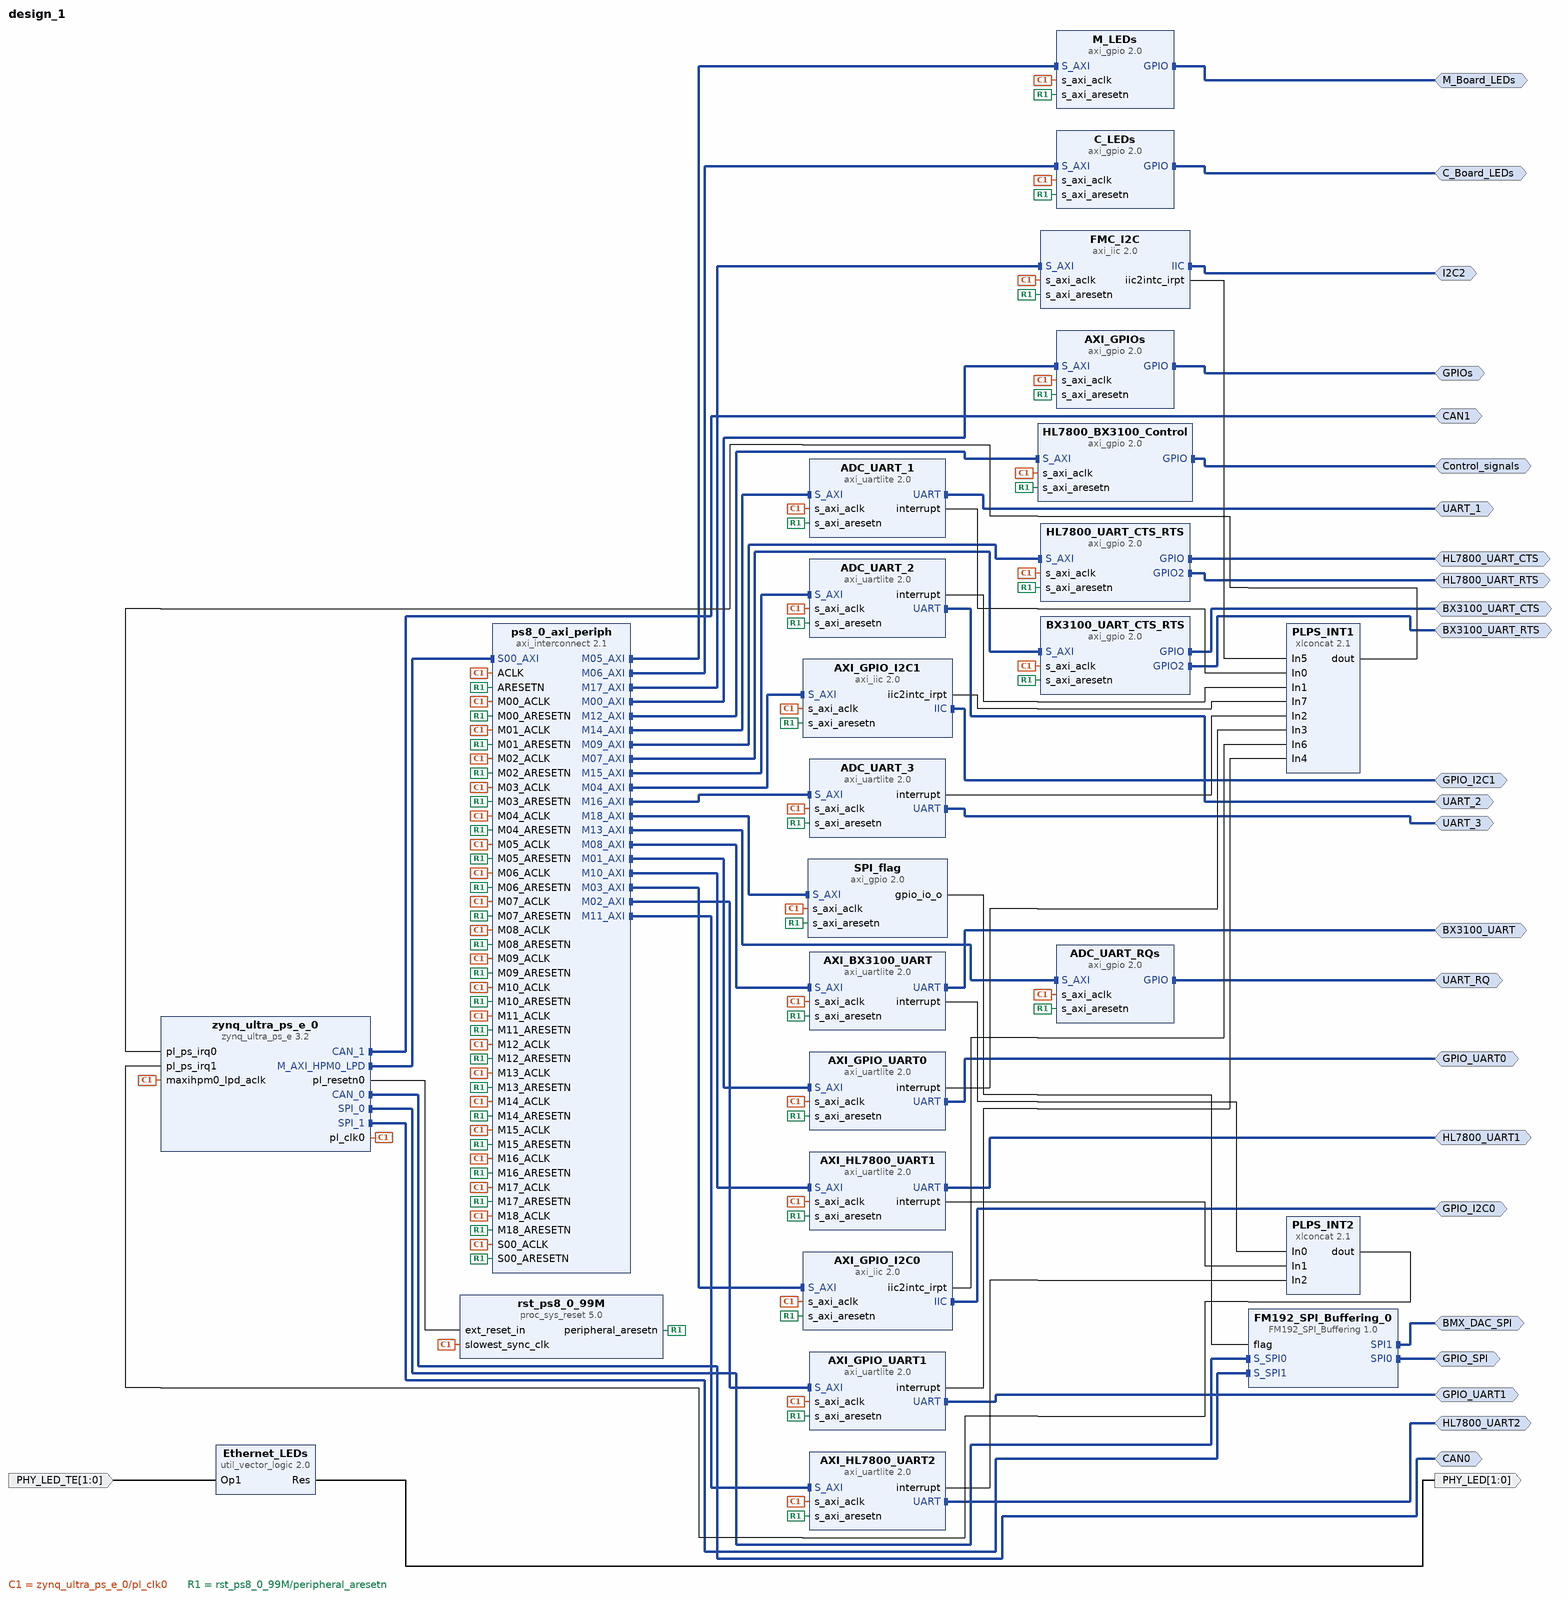
[diagram p0: block diagram of the top level]
# Vivado block design design_1, xczu4cg-sfvc784-1-e, Vivado 2018.3
create_bd_design design_1

create_bd_intf_port -mode Master -vlnv xilinx.com:interface:can_rtl:1.0 CAN0
create_bd_intf_port -mode Master -vlnv xilinx.com:interface:can_rtl:1.0 CAN1
create_bd_intf_port -mode Master -vlnv xilinx.com:interface:gpio_rtl:1.0 GPIOs
create_bd_intf_port -mode Master -vlnv sundance.com:user:Dual_SPI_rtl:1.0 GPIO_SPI
create_bd_intf_port -mode Master -vlnv sundance.com:user:Quad_SPI_rtl:1.0 BMX_DAC_SPI
create_bd_intf_port -mode Master -vlnv xilinx.com:interface:uart_rtl:1.0 GPIO_UART0
create_bd_intf_port -mode Master -vlnv xilinx.com:interface:uart_rtl:1.0 GPIO_UART1
create_bd_intf_port -mode Master -vlnv xilinx.com:interface:iic_rtl:1.0 GPIO_I2C0
create_bd_intf_port -mode Master -vlnv xilinx.com:interface:iic_rtl:1.0 GPIO_I2C1
create_bd_intf_port -mode Master -vlnv xilinx.com:interface:gpio_rtl:1.0 M_Board_LEDs
create_bd_intf_port -mode Master -vlnv xilinx.com:interface:gpio_rtl:1.0 C_Board_LEDs
create_bd_intf_port -mode Master -vlnv xilinx.com:interface:gpio_rtl:1.0 BX3100_UART_CTS
create_bd_intf_port -mode Master -vlnv xilinx.com:interface:gpio_rtl:1.0 BX3100_UART_RTS
create_bd_intf_port -mode Master -vlnv xilinx.com:interface:uart_rtl:1.0 BX3100_UART
create_bd_intf_port -mode Master -vlnv xilinx.com:interface:gpio_rtl:1.0 HL7800_UART_CTS
create_bd_intf_port -mode Master -vlnv xilinx.com:interface:gpio_rtl:1.0 HL7800_UART_RTS
create_bd_intf_port -mode Master -vlnv xilinx.com:interface:uart_rtl:1.0 HL7800_UART1
create_bd_intf_port -mode Master -vlnv xilinx.com:interface:uart_rtl:1.0 HL7800_UART2
create_bd_intf_port -mode Master -vlnv xilinx.com:interface:gpio_rtl:1.0 Control_signals
create_bd_intf_port -mode Master -vlnv xilinx.com:interface:gpio_rtl:1.0 UART_RQ
create_bd_intf_port -mode Master -vlnv xilinx.com:interface:uart_rtl:1.0 UART_1
create_bd_intf_port -mode Master -vlnv xilinx.com:interface:uart_rtl:1.0 UART_2
create_bd_intf_port -mode Master -vlnv xilinx.com:interface:uart_rtl:1.0 UART_3
create_bd_intf_port -mode Master -vlnv xilinx.com:interface:iic_rtl:1.0 I2C2
create_bd_port -dir I -from 1 -to 0 PHY_LED_TE
create_bd_port -dir O -from 1 -to 0 PHY_LED

create_bd_cell -type ip -vlnv xilinx.com:ip:zynq_ultra_ps_e:3.2 zynq_ultra_ps_e_0
set_property -dict [list \
  CONFIG.PSU_BANK_0_IO_STANDARD LVCMOS18 \
  CONFIG.PSU_BANK_1_IO_STANDARD LVCMOS33 \
  CONFIG.PSU_BANK_2_IO_STANDARD LVCMOS18 \
  CONFIG.PSU_BANK_3_IO_STANDARD LVCMOS18 \
  CONFIG.PSU__CAN0__PERIPHERAL__ENABLE 1 \
  CONFIG.PSU__CAN0__PERIPHERAL__IO EMIO \
  CONFIG.PSU__CAN1__PERIPHERAL__ENABLE 1 \
  CONFIG.PSU__CAN1__PERIPHERAL__IO EMIO \
  CONFIG.PSU__CRF_APB__DDR_CTRL__FREQMHZ 1200 \
  CONFIG.PSU__CRF_APB__DDR_CTRL__SRCSEL DPLL \
  CONFIG.PSU__CRL_APB__PL1_REF_CTRL__FREQMHZ 50 \
  CONFIG.PSU__CRL_APB__SPI0_REF_CTRL__FREQMHZ 20 \
  CONFIG.PSU__CRL_APB__USB3__ENABLE 1 \
  CONFIG.PSU__DDRC__BUS_WIDTH {32 Bit} \
  CONFIG.PSU__DDRC__COMPONENTS Components \
  CONFIG.PSU__DDRC__DEVICE_CAPACITY {8192 MBits} \
  CONFIG.PSU__DDRC__DRAM_WIDTH {16 Bits} \
  CONFIG.PSU__DDRC__ECC Disabled \
  CONFIG.PSU__DDRC__MEMORY_TYPE {DDR 4} \
  CONFIG.PSU__DDRC__SPEED_BIN DDR4_2400P \
  CONFIG.PSU__DDR_HIGH_ADDRESS_GUI_ENABLE 0 \
  CONFIG.PSU__DDR__INTERFACE__FREQMHZ 600.000 \
  CONFIG.PSU__DLL__ISUSED 1 \
  CONFIG.PSU__ENET3__FIFO__ENABLE 0 \
  CONFIG.PSU__ENET3__GRP_MDIO__ENABLE 1 \
  CONFIG.PSU__ENET3__GRP_MDIO__IO {MIO 76 .. 77} \
  CONFIG.PSU__ENET3__PERIPHERAL__ENABLE 1 \
  CONFIG.PSU__ENET3__PERIPHERAL__IO {MIO 64 .. 75} \
  CONFIG.PSU__ENET3__PTP__ENABLE 0 \
  CONFIG.PSU__ENET3__TSU__ENABLE 0 \
  CONFIG.PSU__FPGA_PL1_ENABLE 1 \
  CONFIG.PSU__GEM3_COHERENCY 0 \
  CONFIG.PSU__GEM__TSU__ENABLE 0 \
  CONFIG.PSU__GPIO0_MIO__IO {MIO 0 .. 25} \
  CONFIG.PSU__GPIO0_MIO__PERIPHERAL__ENABLE 1 \
  CONFIG.PSU__I2C0__PERIPHERAL__ENABLE 1 \
  CONFIG.PSU__I2C0__PERIPHERAL__IO {MIO 38 .. 39} \
  CONFIG.PSU__I2C1__PERIPHERAL__ENABLE 1 \
  CONFIG.PSU__I2C1__PERIPHERAL__IO {MIO 28 .. 29} \
  CONFIG.PSU__PSS_REF_CLK__FREQMHZ 33.33333 \
  CONFIG.PSU__QSPI_COHERENCY 0 \
  CONFIG.PSU__QSPI__GRP_FBCLK__ENABLE 1 \
  CONFIG.PSU__QSPI__GRP_FBCLK__IO {MIO 6} \
  CONFIG.PSU__QSPI__PERIPHERAL__DATA_MODE x4 \
  CONFIG.PSU__QSPI__PERIPHERAL__ENABLE 1 \
  CONFIG.PSU__QSPI__PERIPHERAL__IO {MIO 0 .. 12} \
  CONFIG.PSU__QSPI__PERIPHERAL__MODE {Dual Parallel} \
  CONFIG.PSU__SATA__LANE1__IO {GT Lane1} \
  CONFIG.PSU__SATA__PERIPHERAL__ENABLE 1 \
  CONFIG.PSU__SATA__REF_CLK_FREQ 150 \
  CONFIG.PSU__SATA__REF_CLK_SEL {Ref Clk1} \
  CONFIG.PSU__SD0__DATA_TRANSFER_MODE 8Bit \
  CONFIG.PSU__SD0__GRP_POW__ENABLE 1 \
  CONFIG.PSU__SD0__GRP_POW__IO {MIO 23} \
  CONFIG.PSU__SD0__PERIPHERAL__ENABLE 1 \
  CONFIG.PSU__SD0__PERIPHERAL__IO {MIO 13 .. 22} \
  CONFIG.PSU__SD0__RESET__ENABLE 1 \
  CONFIG.PSU__SD0__SLOT_TYPE eMMC \
  CONFIG.PSU__SD1_COHERENCY 0 \
  CONFIG.PSU__SD1__DATA_TRANSFER_MODE 4Bit \
  CONFIG.PSU__SD1__GRP_CD__ENABLE 0 \
  CONFIG.PSU__SD1__GRP_POW__ENABLE 0 \
  CONFIG.PSU__SD1__GRP_WP__ENABLE 0 \
  CONFIG.PSU__SD1__PERIPHERAL__ENABLE 1 \
  CONFIG.PSU__SD1__PERIPHERAL__IO {MIO 46 .. 51} \
  CONFIG.PSU__SD1__SLOT_TYPE {SD 2.0} \
  CONFIG.PSU__SPI0__GRP_SS0__IO EMIO \
  CONFIG.PSU__SPI0__GRP_SS1__ENABLE 1 \
  CONFIG.PSU__SPI0__GRP_SS1__IO EMIO \
  CONFIG.PSU__SPI0__PERIPHERAL__ENABLE 1 \
  CONFIG.PSU__SPI0__PERIPHERAL__IO EMIO \
  CONFIG.PSU__SPI1__GRP_SS0__IO EMIO \
  CONFIG.PSU__SPI1__GRP_SS1__ENABLE 1 \
  CONFIG.PSU__SPI1__GRP_SS1__IO EMIO \
  CONFIG.PSU__SPI1__GRP_SS2__ENABLE 1 \
  CONFIG.PSU__SPI1__GRP_SS2__IO EMIO \
  CONFIG.PSU__SPI1__PERIPHERAL__ENABLE 1 \
  CONFIG.PSU__SPI1__PERIPHERAL__IO EMIO \
  CONFIG.PSU__SWDT0__CLOCK__ENABLE 0 \
  CONFIG.PSU__SWDT0__PERIPHERAL__ENABLE 1 \
  CONFIG.PSU__SWDT0__RESET__ENABLE 0 \
  CONFIG.PSU__SWDT1__CLOCK__ENABLE 0 \
  CONFIG.PSU__SWDT1__PERIPHERAL__ENABLE 1 \
  CONFIG.PSU__SWDT1__RESET__ENABLE 0 \
  CONFIG.PSU__TSU__BUFG_PORT_PAIR 0 \
  CONFIG.PSU__TTC0__CLOCK__ENABLE 0 \
  CONFIG.PSU__TTC0__PERIPHERAL__ENABLE 1 \
  CONFIG.PSU__TTC0__WAVEOUT__ENABLE 0 \
  CONFIG.PSU__TTC1__CLOCK__ENABLE 0 \
  CONFIG.PSU__TTC1__PERIPHERAL__ENABLE 1 \
  CONFIG.PSU__TTC1__WAVEOUT__ENABLE 0 \
  CONFIG.PSU__TTC2__CLOCK__ENABLE 0 \
  CONFIG.PSU__TTC2__PERIPHERAL__ENABLE 1 \
  CONFIG.PSU__TTC2__WAVEOUT__ENABLE 0 \
  CONFIG.PSU__TTC3__CLOCK__ENABLE 0 \
  CONFIG.PSU__TTC3__PERIPHERAL__ENABLE 1 \
  CONFIG.PSU__TTC3__WAVEOUT__ENABLE 0 \
  CONFIG.PSU__UART0__BAUD_RATE 115200 \
  CONFIG.PSU__UART0__MODEM__ENABLE 0 \
  CONFIG.PSU__UART0__PERIPHERAL__ENABLE 1 \
  CONFIG.PSU__UART0__PERIPHERAL__IO {MIO 30 .. 31} \
  CONFIG.PSU__USB0_COHERENCY 0 \
  CONFIG.PSU__USB0__PERIPHERAL__ENABLE 1 \
  CONFIG.PSU__USB0__PERIPHERAL__IO {MIO 52 .. 63} \
  CONFIG.PSU__USB0__REF_CLK_FREQ 100 \
  CONFIG.PSU__USB0__REF_CLK_SEL {Ref Clk0} \
  CONFIG.PSU__USB2_0__EMIO__ENABLE 0 \
  CONFIG.PSU__USB3_0__EMIO__ENABLE 0 \
  CONFIG.PSU__USB3_0__PERIPHERAL__ENABLE 1 \
  CONFIG.PSU__USB3_0__PERIPHERAL__IO {GT Lane0} \
  CONFIG.PSU__USB__RESET__MODE {Boot Pin} \
  CONFIG.PSU__USB__RESET__POLARITY {Active Low} \
  CONFIG.PSU__USE__IRQ0 1 \
  CONFIG.PSU__USE__IRQ1 1 \
  CONFIG.SUBPRESET1 Custom \
] [get_bd_cells zynq_ultra_ps_e_0]
# 105 more settings of zynq_ultra_ps_e_0 are not shown: defaults, MIO pin electricals, DDR timing, and values the tool derives
create_bd_cell -type ip -vlnv xilinx.com:ip:util_vector_logic:2.0 Ethernet_LEDs
set_property -dict {CONFIG.C_OPERATION not CONFIG.C_SIZE 2} [get_bd_cells Ethernet_LEDs]
create_bd_cell -type ip -vlnv xilinx.com:ip:axi_gpio:2.0 AXI_GPIOs
set_property -dict [list \
  CONFIG.GPIO_BOARD_INTERFACE fmc_lpc_connector_onboardgpios \
  CONFIG.USE_BOARD_FLOW true \
] [get_bd_cells AXI_GPIOs]
create_bd_cell -type ip -vlnv sundance.com:user:FM192_SPI_Buffering:1.0 FM192_SPI_Buffering_0
create_bd_cell -type ip -vlnv xilinx.com:ip:axi_gpio:2.0 SPI_flag
set_property -dict {CONFIG.C_ALL_OUTPUTS 1 CONFIG.C_GPIO_WIDTH 1} [get_bd_cells SPI_flag]
create_bd_cell -type ip -vlnv xilinx.com:ip:axi_uartlite:2.0 AXI_GPIO_UART0
set_property -dict [list \
  CONFIG.UARTLITE_BOARD_INTERFACE fmc_lpc_connector_gpio_uart0 \
  CONFIG.USE_BOARD_FLOW true \
] [get_bd_cells AXI_GPIO_UART0]
create_bd_cell -type ip -vlnv xilinx.com:ip:axi_uartlite:2.0 AXI_GPIO_UART1
set_property -dict [list \
  CONFIG.UARTLITE_BOARD_INTERFACE fmc_lpc_connector_gpio_uart1 \
  CONFIG.USE_BOARD_FLOW true \
] [get_bd_cells AXI_GPIO_UART1]
create_bd_cell -type ip -vlnv xilinx.com:ip:axi_iic:2.0 AXI_GPIO_I2C0
set_property -dict [list \
  CONFIG.C_GPO_WIDTH 1 \
  CONFIG.IIC_BOARD_INTERFACE fmc_lpc_connector_gpio_i2c0 \
  CONFIG.IIC_FREQ_KHZ 400 \
  CONFIG.USE_BOARD_FLOW true \
] [get_bd_cells AXI_GPIO_I2C0]
create_bd_cell -type ip -vlnv xilinx.com:ip:axi_iic:2.0 AXI_GPIO_I2C1
set_property -dict [list \
  CONFIG.C_GPO_WIDTH 1 \
  CONFIG.IIC_BOARD_INTERFACE fmc_lpc_connector_gpio_i2c1 \
  CONFIG.IIC_FREQ_KHZ 400 \
  CONFIG.USE_BOARD_FLOW true \
] [get_bd_cells AXI_GPIO_I2C1]
create_bd_cell -type ip -vlnv xilinx.com:ip:axi_gpio:2.0 M_LEDs
set_property -dict {CONFIG.GPIO_BOARD_INTERFACE fmc_lpc_connector_onboardleds CONFIG.USE_BOARD_FLOW true} [get_bd_cells M_LEDs]
create_bd_cell -type ip -vlnv xilinx.com:ip:axi_gpio:2.0 C_LEDs
set_property -dict {CONFIG.GPIO_BOARD_INTERFACE onboardleds CONFIG.USE_BOARD_FLOW true} [get_bd_cells C_LEDs]
create_bd_cell -type ip -vlnv xilinx.com:ip:axi_gpio:2.0 BX3100_UART_CTS_RTS
set_property -dict [list \
  CONFIG.GPIO2_BOARD_INTERFACE fmc_lpc_connector_bx3100_uart_rts \
  CONFIG.GPIO_BOARD_INTERFACE fmc_lpc_connector_bx3100_uart_cts \
  CONFIG.USE_BOARD_FLOW true \
] [get_bd_cells BX3100_UART_CTS_RTS]
create_bd_cell -type ip -vlnv xilinx.com:ip:axi_uartlite:2.0 AXI_BX3100_UART
set_property -dict [list \
  CONFIG.UARTLITE_BOARD_INTERFACE fmc_lpc_connector_bx3100_uart \
  CONFIG.USE_BOARD_FLOW true \
] [get_bd_cells AXI_BX3100_UART]
create_bd_cell -type ip -vlnv xilinx.com:ip:axi_gpio:2.0 HL7800_UART_CTS_RTS
set_property -dict [list \
  CONFIG.GPIO2_BOARD_INTERFACE fmc_lpc_connector_hl7800_uart_rts \
  CONFIG.GPIO_BOARD_INTERFACE fmc_lpc_connector_hl7800_uart_cts \
  CONFIG.USE_BOARD_FLOW true \
] [get_bd_cells HL7800_UART_CTS_RTS]
create_bd_cell -type ip -vlnv xilinx.com:ip:axi_uartlite:2.0 AXI_HL7800_UART1
set_property -dict [list \
  CONFIG.UARTLITE_BOARD_INTERFACE fmc_lpc_connector_hl7800_uart1 \
  CONFIG.USE_BOARD_FLOW true \
] [get_bd_cells AXI_HL7800_UART1]
create_bd_cell -type ip -vlnv xilinx.com:ip:axi_uartlite:2.0 AXI_HL7800_UART2
set_property -dict [list \
  CONFIG.UARTLITE_BOARD_INTERFACE fmc_lpc_connector_hl7800_uart2 \
  CONFIG.USE_BOARD_FLOW true \
] [get_bd_cells AXI_HL7800_UART2]
create_bd_cell -type ip -vlnv xilinx.com:ip:axi_gpio:2.0 HL7800_BX3100_Control
set_property -dict [list \
  CONFIG.GPIO_BOARD_INTERFACE fmc_lpc_connector_control_signals \
  CONFIG.USE_BOARD_FLOW true \
] [get_bd_cells HL7800_BX3100_Control]
create_bd_cell -type ip -vlnv xilinx.com:ip:axi_gpio:2.0 ADC_UART_RQs
set_property -dict [list \
  CONFIG.GPIO_BOARD_INTERFACE fmc_lpc_connector_adc_uart_rq \
  CONFIG.USE_BOARD_FLOW true \
] [get_bd_cells ADC_UART_RQs]
create_bd_cell -type ip -vlnv xilinx.com:ip:axi_uartlite:2.0 ADC_UART_1
set_property -dict [list \
  CONFIG.UARTLITE_BOARD_INTERFACE fmc_lpc_connector_adc_uart_1 \
  CONFIG.USE_BOARD_FLOW true \
] [get_bd_cells ADC_UART_1]
create_bd_cell -type ip -vlnv xilinx.com:ip:axi_uartlite:2.0 ADC_UART_2
set_property -dict [list \
  CONFIG.UARTLITE_BOARD_INTERFACE fmc_lpc_connector_adc_uart_2 \
  CONFIG.USE_BOARD_FLOW true \
] [get_bd_cells ADC_UART_2]
create_bd_cell -type ip -vlnv xilinx.com:ip:axi_uartlite:2.0 ADC_UART_3
set_property -dict [list \
  CONFIG.UARTLITE_BOARD_INTERFACE fmc_lpc_connector_adc_uart_3 \
  CONFIG.USE_BOARD_FLOW true \
] [get_bd_cells ADC_UART_3]
create_bd_cell -type ip -vlnv xilinx.com:ip:axi_iic:2.0 FMC_I2C
set_property -dict [list \
  CONFIG.C_GPO_WIDTH 1 \
  CONFIG.IIC_BOARD_INTERFACE fmc_lpc_connector_i2c_fmcbus \
  CONFIG.IIC_FREQ_KHZ 400 \
  CONFIG.USE_BOARD_FLOW true \
] [get_bd_cells FMC_I2C]
create_bd_cell -type ip -vlnv xilinx.com:ip:xlconcat:2.1 PLPS_INT1
set_property -dict {CONFIG.IN0_WIDTH 1 CONFIG.IN1_WIDTH 1 CONFIG.IN2_WIDTH 1 CONFIG.NUM_PORTS 8} [get_bd_cells PLPS_INT1]
create_bd_cell -type ip -vlnv xilinx.com:ip:xlconcat:2.1 PLPS_INT2
set_property -dict {CONFIG.IN0_WIDTH 1 CONFIG.IN1_WIDTH 1 CONFIG.IN2_WIDTH 1 CONFIG.NUM_PORTS 3} [get_bd_cells PLPS_INT2]
create_bd_cell -type ip -vlnv xilinx.com:ip:axi_interconnect:2.1 ps8_0_axi_periph
set_property -dict {CONFIG.NUM_MI 19} [get_bd_cells ps8_0_axi_periph]
create_bd_cell -type ip -vlnv xilinx.com:ip:proc_sys_reset:5.0 rst_ps8_0_99M

# ---- connections ----

connect_bd_intf_net -intf_net axi_uartlite_0_UART3 [get_bd_intf_ports HL7800_UART1] [get_bd_intf_pins AXI_HL7800_UART1/UART]
connect_bd_intf_net -intf_net axi_iic_0_IIC1 [get_bd_intf_ports GPIO_I2C1] [get_bd_intf_pins AXI_GPIO_I2C1/IIC]
connect_bd_intf_net -intf_net axi_gpio_0_GPIO1 [get_bd_intf_ports M_Board_LEDs] [get_bd_intf_pins M_LEDs/GPIO]
connect_bd_intf_net [get_bd_intf_pins ps8_0_axi_periph/M03_AXI] [get_bd_intf_pins AXI_GPIO_I2C0/S_AXI]
connect_bd_intf_net -intf_net axi_gpio_0_GPIO [get_bd_intf_ports GPIOs] [get_bd_intf_pins AXI_GPIOs/GPIO]
connect_bd_intf_net [get_bd_intf_pins ps8_0_axi_periph/M02_AXI] [get_bd_intf_pins AXI_GPIO_UART1/S_AXI]
connect_bd_intf_net -intf_net axi_uartlite_0_UART7 [get_bd_intf_ports UART_3] [get_bd_intf_pins ADC_UART_3/UART]
connect_bd_intf_net -intf_net axi_gpio_0_GPIO2 [get_bd_intf_ports C_Board_LEDs] [get_bd_intf_pins C_LEDs/GPIO]
connect_bd_intf_net -intf_net axi_gpio_0_GPIO8 [get_bd_intf_ports UART_RQ] [get_bd_intf_pins ADC_UART_RQs/GPIO]
connect_bd_intf_net [get_bd_intf_ports CAN1] [get_bd_intf_pins zynq_ultra_ps_e_0/CAN_1]
connect_bd_intf_net [get_bd_intf_pins ps8_0_axi_periph/M01_AXI] [get_bd_intf_pins AXI_GPIO_UART0/S_AXI]
connect_bd_intf_net [get_bd_intf_pins ps8_0_axi_periph/M00_AXI] [get_bd_intf_pins AXI_GPIOs/S_AXI]
connect_bd_intf_net -intf_net axi_uartlite_0_UART6 [get_bd_intf_ports UART_2] [get_bd_intf_pins ADC_UART_2/UART]
connect_bd_intf_net [get_bd_intf_pins zynq_ultra_ps_e_0/M_AXI_HPM0_LPD] [get_bd_intf_pins ps8_0_axi_periph/S00_AXI]
connect_bd_intf_net -intf_net axi_uartlite_0_UART5 [get_bd_intf_ports UART_1] [get_bd_intf_pins ADC_UART_1/UART]
connect_bd_intf_net -intf_net axi_iic_0_IIC2 [get_bd_intf_ports I2C2] [get_bd_intf_pins FMC_I2C/IIC]
connect_bd_intf_net -intf_net axi_uartlite_0_UART [get_bd_intf_ports GPIO_UART0] [get_bd_intf_pins AXI_GPIO_UART0/UART]
connect_bd_intf_net -intf_net axi_uartlite_0_UART1 [get_bd_intf_ports GPIO_UART1] [get_bd_intf_pins AXI_GPIO_UART1/UART]
connect_bd_intf_net [get_bd_intf_ports CAN0] [get_bd_intf_pins zynq_ultra_ps_e_0/CAN_0]
connect_bd_intf_net [get_bd_intf_pins ps8_0_axi_periph/M12_AXI] [get_bd_intf_pins HL7800_BX3100_Control/S_AXI]
connect_bd_intf_net -intf_net axi_uartlite_0_UART2 [get_bd_intf_ports BX3100_UART] [get_bd_intf_pins AXI_BX3100_UART/UART]
connect_bd_intf_net -intf_net axi_gpio_0_GPIO5 [get_bd_intf_ports HL7800_UART_CTS] [get_bd_intf_pins HL7800_UART_CTS_RTS/GPIO]
connect_bd_intf_net -intf_net axi_gpio_0_GPIO6 [get_bd_intf_ports HL7800_UART_RTS] [get_bd_intf_pins HL7800_UART_CTS_RTS/GPIO2]
connect_bd_intf_net -intf_net axi_gpio_0_GPIO3 [get_bd_intf_ports BX3100_UART_CTS] [get_bd_intf_pins BX3100_UART_CTS_RTS/GPIO]
connect_bd_intf_net -intf_net axi_gpio_0_GPIO4 [get_bd_intf_ports BX3100_UART_RTS] [get_bd_intf_pins BX3100_UART_CTS_RTS/GPIO2]
connect_bd_intf_net [get_bd_intf_pins zynq_ultra_ps_e_0/SPI_0] [get_bd_intf_pins FM192_SPI_Buffering_0/S_SPI0]
connect_bd_intf_net [get_bd_intf_pins zynq_ultra_ps_e_0/SPI_1] [get_bd_intf_pins FM192_SPI_Buffering_0/S_SPI1]
connect_bd_intf_net [get_bd_intf_ports BMX_DAC_SPI] [get_bd_intf_pins FM192_SPI_Buffering_0/SPI1]
connect_bd_intf_net [get_bd_intf_ports GPIO_SPI] [get_bd_intf_pins FM192_SPI_Buffering_0/SPI0]
connect_bd_intf_net -intf_net axi_iic_0_IIC [get_bd_intf_ports GPIO_I2C0] [get_bd_intf_pins AXI_GPIO_I2C0/IIC]
connect_bd_intf_net -intf_net axi_gpio_0_GPIO7 [get_bd_intf_ports Control_signals] [get_bd_intf_pins HL7800_BX3100_Control/GPIO]
connect_bd_intf_net -intf_net axi_uartlite_0_UART4 [get_bd_intf_ports HL7800_UART2] [get_bd_intf_pins AXI_HL7800_UART2/UART]
connect_bd_intf_net [get_bd_intf_pins ps8_0_axi_periph/M04_AXI] [get_bd_intf_pins AXI_GPIO_I2C1/S_AXI]
connect_bd_intf_net [get_bd_intf_pins ps8_0_axi_periph/M05_AXI] [get_bd_intf_pins M_LEDs/S_AXI]
connect_bd_intf_net [get_bd_intf_pins ps8_0_axi_periph/M06_AXI] [get_bd_intf_pins C_LEDs/S_AXI]
connect_bd_intf_net [get_bd_intf_pins ps8_0_axi_periph/M14_AXI] [get_bd_intf_pins ADC_UART_1/S_AXI]
connect_bd_intf_net [get_bd_intf_pins ps8_0_axi_periph/M09_AXI] [get_bd_intf_pins HL7800_UART_CTS_RTS/S_AXI]
connect_bd_intf_net [get_bd_intf_pins ps8_0_axi_periph/M10_AXI] [get_bd_intf_pins AXI_HL7800_UART1/S_AXI]
connect_bd_intf_net [get_bd_intf_pins ps8_0_axi_periph/M13_AXI] [get_bd_intf_pins ADC_UART_RQs/S_AXI]
connect_bd_intf_net [get_bd_intf_pins ps8_0_axi_periph/M11_AXI] [get_bd_intf_pins AXI_HL7800_UART2/S_AXI]
connect_bd_intf_net [get_bd_intf_pins ps8_0_axi_periph/M07_AXI] [get_bd_intf_pins BX3100_UART_CTS_RTS/S_AXI]
connect_bd_intf_net [get_bd_intf_pins ps8_0_axi_periph/M08_AXI] [get_bd_intf_pins AXI_BX3100_UART/S_AXI]
connect_bd_intf_net [get_bd_intf_pins ps8_0_axi_periph/M15_AXI] [get_bd_intf_pins ADC_UART_2/S_AXI]
connect_bd_intf_net [get_bd_intf_pins ps8_0_axi_periph/M16_AXI] [get_bd_intf_pins ADC_UART_3/S_AXI]
connect_bd_intf_net [get_bd_intf_pins ps8_0_axi_periph/M18_AXI] [get_bd_intf_pins SPI_flag/S_AXI]
connect_bd_intf_net [get_bd_intf_pins ps8_0_axi_periph/M17_AXI] [get_bd_intf_pins FMC_I2C/S_AXI]
connect_bd_net -net Op1_0_1 [get_bd_ports PHY_LED_TE] [get_bd_pins Ethernet_LEDs/Op1]
connect_bd_net -net util_vector_logic_0_Res [get_bd_pins Ethernet_LEDs/Res] [get_bd_ports PHY_LED]
connect_bd_net -net axi_gpio_0_gpio_io_o [get_bd_pins SPI_flag/gpio_io_o] [get_bd_pins FM192_SPI_Buffering_0/flag]
connect_bd_net [get_bd_pins ADC_UART_1/interrupt] [get_bd_pins PLPS_INT1/In0]
connect_bd_net [get_bd_pins ADC_UART_2/interrupt] [get_bd_pins PLPS_INT1/In1]
connect_bd_net [get_bd_pins ADC_UART_3/interrupt] [get_bd_pins PLPS_INT1/In2]
connect_bd_net [get_bd_pins AXI_GPIO_UART0/interrupt] [get_bd_pins PLPS_INT1/In3]
connect_bd_net [get_bd_pins AXI_GPIO_UART1/interrupt] [get_bd_pins PLPS_INT1/In4]
connect_bd_net [get_bd_pins FMC_I2C/iic2intc_irpt] [get_bd_pins PLPS_INT1/In5]
connect_bd_net [get_bd_pins AXI_GPIO_I2C0/iic2intc_irpt] [get_bd_pins PLPS_INT1/In6]
connect_bd_net [get_bd_pins AXI_GPIO_I2C1/iic2intc_irpt] [get_bd_pins PLPS_INT1/In7]
connect_bd_net [get_bd_pins PLPS_INT1/dout] [get_bd_pins zynq_ultra_ps_e_0/pl_ps_irq0]
connect_bd_net [get_bd_pins AXI_BX3100_UART/interrupt] [get_bd_pins PLPS_INT2/In0]
connect_bd_net [get_bd_pins AXI_HL7800_UART1/interrupt] [get_bd_pins PLPS_INT2/In1]
connect_bd_net [get_bd_pins AXI_HL7800_UART2/interrupt] [get_bd_pins PLPS_INT2/In2]
connect_bd_net [get_bd_pins PLPS_INT2/dout] [get_bd_pins zynq_ultra_ps_e_0/pl_ps_irq1]
connect_bd_net [get_bd_pins zynq_ultra_ps_e_0/pl_clk0] \
  [get_bd_pins zynq_ultra_ps_e_0/maxihpm0_lpd_aclk] [get_bd_pins ps8_0_axi_periph/S00_ACLK] \
  [get_bd_pins rst_ps8_0_99M/slowest_sync_clk] [get_bd_pins AXI_GPIOs/s_axi_aclk] [get_bd_pins ps8_0_axi_periph/M00_ACLK] \
  [get_bd_pins ps8_0_axi_periph/ACLK] [get_bd_pins AXI_GPIO_UART0/s_axi_aclk] [get_bd_pins ps8_0_axi_periph/M01_ACLK] \
  [get_bd_pins AXI_GPIO_UART1/s_axi_aclk] [get_bd_pins ps8_0_axi_periph/M02_ACLK] [get_bd_pins AXI_GPIO_I2C0/s_axi_aclk] \
  [get_bd_pins ps8_0_axi_periph/M03_ACLK] [get_bd_pins AXI_GPIO_I2C1/s_axi_aclk] [get_bd_pins ps8_0_axi_periph/M04_ACLK] \
  [get_bd_pins M_LEDs/s_axi_aclk] [get_bd_pins ps8_0_axi_periph/M05_ACLK] [get_bd_pins C_LEDs/s_axi_aclk] \
  [get_bd_pins ps8_0_axi_periph/M06_ACLK] [get_bd_pins BX3100_UART_CTS_RTS/s_axi_aclk] \
  [get_bd_pins ps8_0_axi_periph/M07_ACLK] [get_bd_pins AXI_BX3100_UART/s_axi_aclk] [get_bd_pins ps8_0_axi_periph/M08_ACLK] \
  [get_bd_pins HL7800_UART_CTS_RTS/s_axi_aclk] [get_bd_pins ps8_0_axi_periph/M09_ACLK] \
  [get_bd_pins AXI_HL7800_UART1/s_axi_aclk] [get_bd_pins ps8_0_axi_periph/M10_ACLK] [get_bd_pins AXI_HL7800_UART2/s_axi_aclk] \
  [get_bd_pins ps8_0_axi_periph/M11_ACLK] [get_bd_pins HL7800_BX3100_Control/s_axi_aclk] \
  [get_bd_pins ps8_0_axi_periph/M12_ACLK] [get_bd_pins ADC_UART_RQs/s_axi_aclk] [get_bd_pins ps8_0_axi_periph/M13_ACLK] \
  [get_bd_pins ADC_UART_1/s_axi_aclk] [get_bd_pins ps8_0_axi_periph/M14_ACLK] [get_bd_pins ADC_UART_2/s_axi_aclk] \
  [get_bd_pins ps8_0_axi_periph/M15_ACLK] [get_bd_pins ADC_UART_3/s_axi_aclk] [get_bd_pins ps8_0_axi_periph/M16_ACLK] \
  [get_bd_pins FMC_I2C/s_axi_aclk] [get_bd_pins ps8_0_axi_periph/M17_ACLK] [get_bd_pins SPI_flag/s_axi_aclk] \
  [get_bd_pins ps8_0_axi_periph/M18_ACLK]
connect_bd_net [get_bd_pins zynq_ultra_ps_e_0/pl_resetn0] [get_bd_pins rst_ps8_0_99M/ext_reset_in]
connect_bd_net [get_bd_pins rst_ps8_0_99M/peripheral_aresetn] \
  [get_bd_pins ps8_0_axi_periph/S00_ARESETN] [get_bd_pins AXI_GPIOs/s_axi_aresetn] [get_bd_pins ps8_0_axi_periph/M00_ARESETN] \
  [get_bd_pins ps8_0_axi_periph/ARESETN] [get_bd_pins AXI_GPIO_UART0/s_axi_aresetn] \
  [get_bd_pins ps8_0_axi_periph/M01_ARESETN] [get_bd_pins AXI_GPIO_UART1/s_axi_aresetn] \
  [get_bd_pins ps8_0_axi_periph/M02_ARESETN] [get_bd_pins AXI_GPIO_I2C0/s_axi_aresetn] \
  [get_bd_pins ps8_0_axi_periph/M03_ARESETN] [get_bd_pins AXI_GPIO_I2C1/s_axi_aresetn] \
  [get_bd_pins ps8_0_axi_periph/M04_ARESETN] [get_bd_pins M_LEDs/s_axi_aresetn] [get_bd_pins ps8_0_axi_periph/M05_ARESETN] \
  [get_bd_pins C_LEDs/s_axi_aresetn] [get_bd_pins ps8_0_axi_periph/M06_ARESETN] \
  [get_bd_pins BX3100_UART_CTS_RTS/s_axi_aresetn] [get_bd_pins ps8_0_axi_periph/M07_ARESETN] \
  [get_bd_pins AXI_BX3100_UART/s_axi_aresetn] [get_bd_pins ps8_0_axi_periph/M08_ARESETN] \
  [get_bd_pins HL7800_UART_CTS_RTS/s_axi_aresetn] [get_bd_pins ps8_0_axi_periph/M09_ARESETN] \
  [get_bd_pins AXI_HL7800_UART1/s_axi_aresetn] [get_bd_pins ps8_0_axi_periph/M10_ARESETN] \
  [get_bd_pins AXI_HL7800_UART2/s_axi_aresetn] [get_bd_pins ps8_0_axi_periph/M11_ARESETN] \
  [get_bd_pins HL7800_BX3100_Control/s_axi_aresetn] [get_bd_pins ps8_0_axi_periph/M12_ARESETN] \
  [get_bd_pins ADC_UART_RQs/s_axi_aresetn] [get_bd_pins ps8_0_axi_periph/M13_ARESETN] [get_bd_pins ADC_UART_1/s_axi_aresetn] \
  [get_bd_pins ps8_0_axi_periph/M14_ARESETN] [get_bd_pins ADC_UART_2/s_axi_aresetn] \
  [get_bd_pins ps8_0_axi_periph/M15_ARESETN] [get_bd_pins ADC_UART_3/s_axi_aresetn] \
  [get_bd_pins ps8_0_axi_periph/M16_ARESETN] [get_bd_pins FMC_I2C/s_axi_aresetn] [get_bd_pins ps8_0_axi_periph/M17_ARESETN] \
  [get_bd_pins SPI_flag/s_axi_aresetn] [get_bd_pins ps8_0_axi_periph/M18_ARESETN]

# ---- address map ----
assign_bd_address -offset 0x0080000000 -range 4K -target_address_space [get_bd_addr_spaces zynq_ultra_ps_e_0/Data] [get_bd_addr_segs AXI_GPIOs/S_AXI/Reg]
assign_bd_address -offset 0x0080001000 -range 4K -target_address_space [get_bd_addr_spaces zynq_ultra_ps_e_0/Data] [get_bd_addr_segs AXI_GPIO_UART0/S_AXI/Reg]
assign_bd_address -offset 0x0080002000 -range 4K -target_address_space [get_bd_addr_spaces zynq_ultra_ps_e_0/Data] [get_bd_addr_segs AXI_GPIO_UART1/S_AXI/Reg]
assign_bd_address -offset 0x0080003000 -range 4K -target_address_space [get_bd_addr_spaces zynq_ultra_ps_e_0/Data] [get_bd_addr_segs AXI_GPIO_I2C0/S_AXI/Reg]
assign_bd_address -offset 0x0080004000 -range 4K -target_address_space [get_bd_addr_spaces zynq_ultra_ps_e_0/Data] [get_bd_addr_segs AXI_GPIO_I2C1/S_AXI/Reg]
assign_bd_address -offset 0x0080005000 -range 4K -target_address_space [get_bd_addr_spaces zynq_ultra_ps_e_0/Data] [get_bd_addr_segs M_LEDs/S_AXI/Reg]
assign_bd_address -offset 0x0080006000 -range 4K -target_address_space [get_bd_addr_spaces zynq_ultra_ps_e_0/Data] [get_bd_addr_segs C_LEDs/S_AXI/Reg]
assign_bd_address -offset 0x0080007000 -range 4K -target_address_space [get_bd_addr_spaces zynq_ultra_ps_e_0/Data] [get_bd_addr_segs BX3100_UART_CTS_RTS/S_AXI/Reg]
assign_bd_address -offset 0x0080008000 -range 4K -target_address_space [get_bd_addr_spaces zynq_ultra_ps_e_0/Data] [get_bd_addr_segs AXI_BX3100_UART/S_AXI/Reg]
assign_bd_address -offset 0x0080009000 -range 4K -target_address_space [get_bd_addr_spaces zynq_ultra_ps_e_0/Data] [get_bd_addr_segs HL7800_UART_CTS_RTS/S_AXI/Reg]
assign_bd_address -offset 0x008000A000 -range 4K -target_address_space [get_bd_addr_spaces zynq_ultra_ps_e_0/Data] [get_bd_addr_segs AXI_HL7800_UART1/S_AXI/Reg]
assign_bd_address -offset 0x008000B000 -range 4K -target_address_space [get_bd_addr_spaces zynq_ultra_ps_e_0/Data] [get_bd_addr_segs AXI_HL7800_UART2/S_AXI/Reg]
assign_bd_address -offset 0x008000C000 -range 4K -target_address_space [get_bd_addr_spaces zynq_ultra_ps_e_0/Data] [get_bd_addr_segs HL7800_BX3100_Control/S_AXI/Reg]
assign_bd_address -offset 0x008000D000 -range 4K -target_address_space [get_bd_addr_spaces zynq_ultra_ps_e_0/Data] [get_bd_addr_segs ADC_UART_RQs/S_AXI/Reg]
assign_bd_address -offset 0x008000E000 -range 4K -target_address_space [get_bd_addr_spaces zynq_ultra_ps_e_0/Data] [get_bd_addr_segs ADC_UART_1/S_AXI/Reg]
assign_bd_address -offset 0x008000F000 -range 4K -target_address_space [get_bd_addr_spaces zynq_ultra_ps_e_0/Data] [get_bd_addr_segs ADC_UART_2/S_AXI/Reg]
assign_bd_address -offset 0x0080010000 -range 4K -target_address_space [get_bd_addr_spaces zynq_ultra_ps_e_0/Data] [get_bd_addr_segs ADC_UART_3/S_AXI/Reg]
assign_bd_address -offset 0x0080011000 -range 4K -target_address_space [get_bd_addr_spaces zynq_ultra_ps_e_0/Data] [get_bd_addr_segs FMC_I2C/S_AXI/Reg]
assign_bd_address -offset 0x0080012000 -range 4K -target_address_space [get_bd_addr_spaces zynq_ultra_ps_e_0/Data] [get_bd_addr_segs SPI_flag/S_AXI/Reg]

validate_bd_design
save_bd_design
